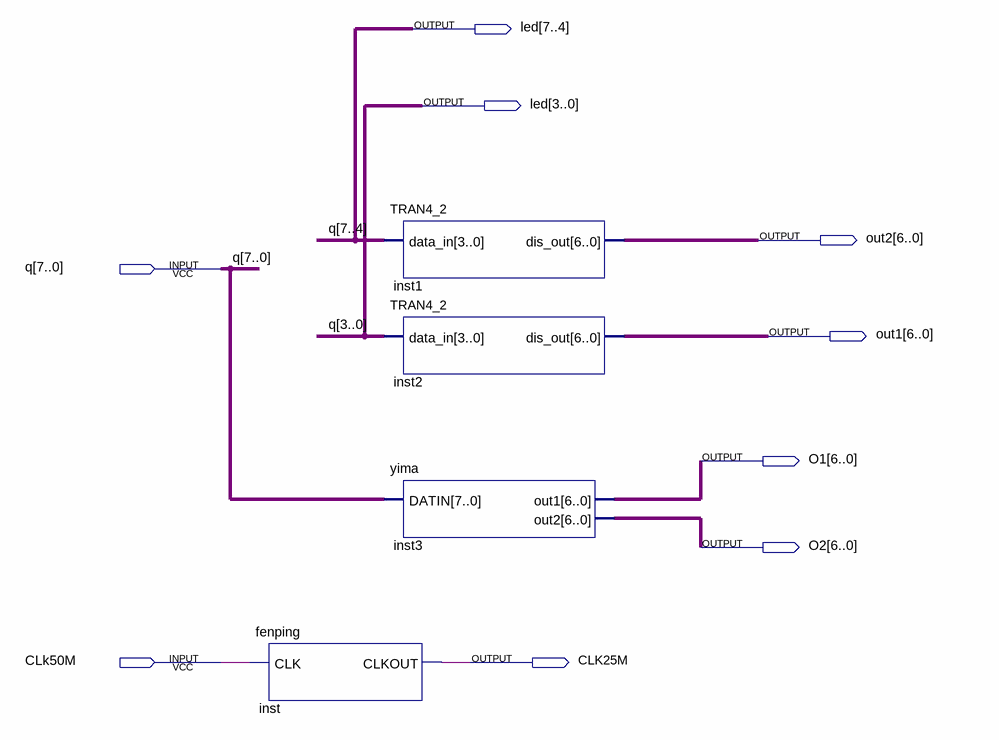
[diagram p0: schematic sheet]
// Quartus schematic test.bdf as structural Verilog: 4 symbols, 9 pins
module test (
  input  [7:0] q,
  input  CLk50M,
  output [7:0] led,
  output [6:0] out2,
  output [6:0] out1,
  output [6:0] O1,
  output [6:0] O2,
  output CLK25M
);

  fenping inst (.CLK(CLk50M), .CLKOUT(CLK25M));
  TRAN4_2 inst1 (.data_in(q[7:4]), .dis_out(out2));
  TRAN4_2 inst2 (.data_in(q[3:0]), .dis_out(out1));
  yima inst3 (.DATIN(q), .out1(O1), .out2(O2));

  assign led = q;
endmodule
